# Altium schematic sheet Base AC System.SchDoc
size A3; DocumentNumber: 2; SheetNumber: 2; SheetTotal: 5; SheetSize: A3; CheckedByDate: 2022-12-15; DrawByDate: 2022-12-15; SiteName: ESG TD Huangpu
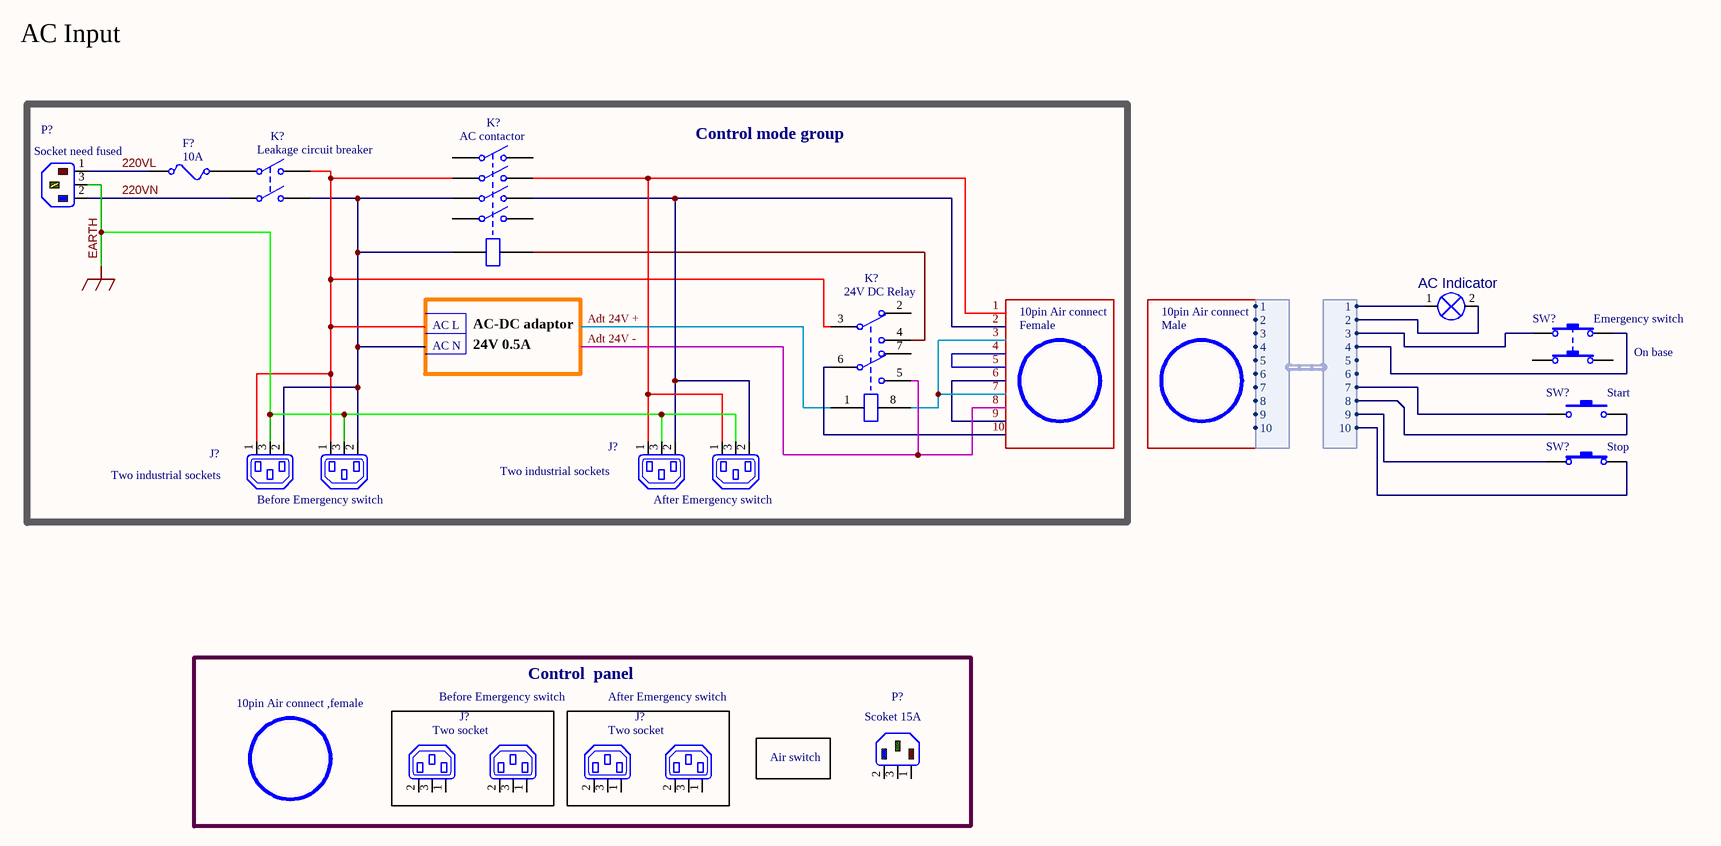
[diagram p0: Base AC System.SchDoc]

## Parts
(Parts that share a designator on the sheet are numbered #1, #2 ... from top to bottom, then left to right.)
F?  10A  [FUSE]
J?#1  Two industrial sockets  [IEC7-2H3]
J?#2  Plug AC Female  [IEC7-2H3]  (value not drawn)
J?#3  Two industrial sockets  [IEC7-2H3]
J?#4  两位工业插座  [IEC7-2H3]  (value not drawn)
J?#5  Two socket  [IEC7-2H3]
J?#6  工业插座  [IEC7-2H3]  (value not drawn)
J?#7  Two socket  [IEC7-2H3]
J?#8  工业插座  [IEC7-2H3]  (value not drawn)
K?#1  Leakage circuit breaker  [DPST-4]
K?#2  AC contactor
K?#3  24V DC Relay  [G2R-2]
Lamp?  AC Indicator
P?#1  Socket need fused  [IEC9.14-2H3]
P?#2  Scoket 15A  [IEC9.14-2H3]
SW?#1  Emergency switch  Remark: On base
SW?#2  Start
SW?#3  Stop

## Blocks framed on the sheet
Control mode group: F? J?#1-J?#4 K?#1-K?#3 P?#1
Control  panel: P?#2
Before Emergency switch: J?#5 J?#6
After Emergency switch: J?#7 J?#8

## Harnesses
Harness8: 1, 2, 3, 4, 5, 6, 7, 8, 9, 10

## Nets
EARTH: J?#1.3(E) J?#2.3(E) J?#3.3(E) J?#4.3(E) P?#1.3(E)  [also labelled GND_EARTH]
1: J?#3.1(L) J?#4.1(L) K?#2.10
2: J?#3.2(N) J?#4.2(N) K?#2.4
3: K?#3.8  [also labelled 7]
8: K?#3.5  [also labelled Adt 24V -]
10: K?#3.6
220VL: F?.1 P?#1.1(L)
220VN: K?#1.3(COMMON2) P?#1.2(N)
Adt 24V +: K?#3.1
NetF?_2: F?.2 K?#1.1(COMMON1)
NetJ?#1_1: J?#1.1(L) J?#2.1(L) K?#1.2(NO1) K?#2.9 K?#3.3
NetJ?#1_2: J?#1.2(N) J?#2.2(N) K?#1.4(NO2) K?#2.1 K?#2.3
NetK?#2_8: K?#2.8 K?#3.4
NetLamp?_1: Lamp?.1 ; harness Harness8.1
NetLamp?_2: Lamp?.2 ; harness Harness8.2
NetSW?#1_1: SW?#1.1 ; harness Harness8.3
NetSW?#1_2: SW?#1.2 ; harness Harness8.4
NetSW?#2_1: SW?#2.1 ; harness Harness8.7
NetSW?#2_2: SW?#2.2 ; harness Harness8.8
NetSW?#3_1: SW?#3.1 ; harness Harness8.9
NetSW?#3_2: SW?#3.2 ; harness Harness8.10

Not connected (* = marked no-connect by the designer): J?#5 1(L) 2(N) 3(E); J?#6 1(L) 2(N) 3(E); J?#7 1(L) 2(N) 3(E); J?#8 1(L) 2(N) 3(E); K?#2 6 7 11 12; K?#3 2 7; P?#2 1(L) 2(N) 3(E); SW?#1 3 4

## Notes on the sheet
- AC Input
- AC L
- AC N
- AC-DC adaptor
- 24V 0.5A
- 10pin Air connect
- Female
- Male
- (near J?#2) Before Emergency switch
- (near J?#3) After Emergency switch
- 10pin Air connect ,female
- Air switch
- Document Number:
- Project Name:
- Rev:
- Drawn By:
- Date:
- Titile:
- Checked By:
- Sheet:
- Of

## Library data of the parts
F? = FUSE
J?#1-J?#8 = Plug AC Female: IEC Mains Power Outlet, EN60 320-2-2 F Class I, PC Flange Rear Mount, Chassis Socket; PackageDocument: ver.80, 15-Sep-2003; MaximumRating: 10A, 250V a.c. (UL & CSA 15A, 250V a.c.); MountingFixtures: Not drawn on schematic symbol.; PCB_Layout: Complies with manufacturer's recommendation.; DrillSize: Corresponds to nominal value.; Published: 15-Jul-2004; LatestRevisionDate: 15-Jul-2004; LatestRevisionNote: Component Replaced & renamed from "Phonejack".; DatasheetDocument: ver.80, 15-Sep-2003; PackageReference: PX0675/PC; Publisher: Altium Limited; Terminations: P.C. Spills; ComponentLink1Description: Manufacturer Link; ComponentLink1URL: http://www.bulgin.co.uk/
K?#1 = SW-DPST: Double-Pole, Single-Throw Switch; Published: 24-Mar-1999; LatestRevisionDate: 17-Jul-2002; LatestRevisionNote: Re-released for DXP Platform.; PackageReference: DPST-4; Publisher: Altium Limited
K?#2 = AC CONTACTER
K?#3 = G2R-2
Lamp? = Lamp3
P?#1 P?#2 = Plug AC Male: IEC Mains Power Inlet, EN60 320-1 C14 Class I Cold Condition, PC Flange Rear Mount, Chassis Plug; PackageDocument: ver.80, 15-Sep-2003; MaximumRating: 10A, 250V a.c. (UL & CSA 15A, 250V a.c.); MountingFixtures: Not drawn on schematic symbol.; PCB_Layout: Complies with manufacturer's recommendation.; DrillSize: Corresponds to nominal value.; Note: IEC Color Scheme employed for L, N and E.; Published: 15-Jul-2004; LatestRevisionDate: 15-Jul-2004; LatestRevisionNote: Component Replaced.; DatasheetDocument: ver.80, 15-Sep-2003; PackageReference: PX0580/PC; Publisher: Altium Limited; Terminations: P.C. Spills; ComponentLink1Description: Manufacturer Link; ComponentLink1URL: http://www.bulgin.co.uk/
SW?#1 = Emergency: Switch; Published: 24-Mar-1999; LatestRevisionDate: 17-Jul-2002; LatestRevisionNote: Re-released for DXP Platform.; PackageReference: SPST-2; Publisher: Altium Limited
SW?#2 = SW-NO: Switch; Published: 24-Mar-1999; LatestRevisionDate: 17-Jul-2002; LatestRevisionNote: Re-released for DXP Platform.; PackageReference: SPST-2; Publisher: Altium Limited
SW?#3 = SW-NC: Switch; Published: 24-Mar-1999; LatestRevisionDate: 17-Jul-2002; LatestRevisionNote: Re-released for DXP Platform.; PackageReference: SPST-2; Publisher: Altium Limited